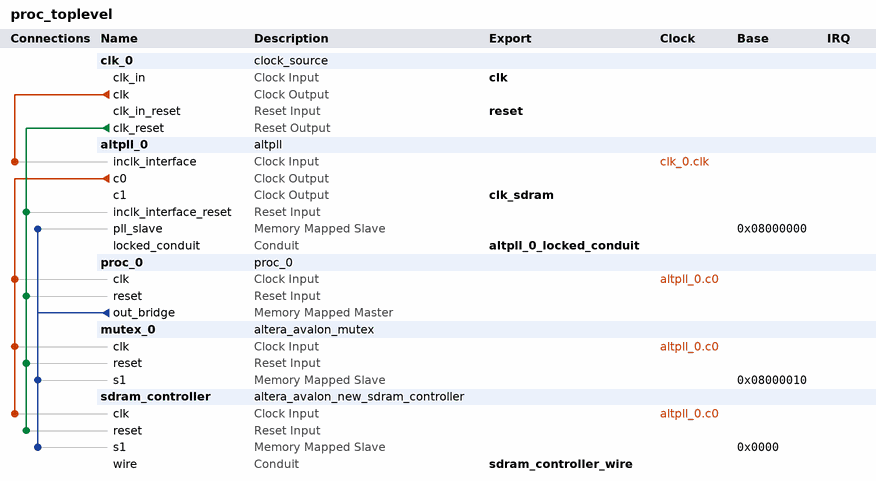
[diagram p0: system contents]
# Platform Designer (Qsys) system proc_toplevel, Cyclone IV E EP4CE115F29C7
# Parameters at their usual value, and those the tool derives, are not listed.
package require -exact qsys 16.1
create_system proc_toplevel
set_project_property DEVICE_FAMILY {Cyclone IV E}
set_project_property DEVICE EP4CE115F29C7

add_instance clk_0 clock_source 16.1
set_instance_parameter_value clk_0 clockFrequency 50000000

add_instance altpll_0 altpll 16.1
set_instance_parameter_value altpll_0 CLK0_DIVIDE_BY 50
set_instance_parameter_value altpll_0 CLK0_MULTIPLY_BY 143
set_instance_parameter_value altpll_0 CLK1_DIVIDE_BY 50
set_instance_parameter_value altpll_0 CLK1_DUTY_CYCLE 50
set_instance_parameter_value altpll_0 CLK1_MULTIPLY_BY 143
set_instance_parameter_value altpll_0 CLK1_PHASE_SHIFT -7000
set_instance_parameter_value altpll_0 COMPENSATE_CLOCK CLK1
set_instance_parameter_value altpll_0 INCLK0_INPUT_FREQUENCY 20000
set_instance_parameter_value altpll_0 PORT_ARESET PORT_UNUSED
set_instance_parameter_value altpll_0 PORT_LOCKED PORT_USED
set_instance_parameter_value altpll_0 PORT_clk1 PORT_USED
set_instance_parameter_value altpll_0 PORT_clk2 PORT_UNUSED
set_instance_parameter_value altpll_0 PORT_clk3 PORT_UNUSED

add_instance proc_0 proc_0 1.0

add_instance mutex_0 altera_avalon_mutex 16.1

add_instance sdram_controller altera_avalon_new_sdram_controller 16.1
set_instance_parameter_value sdram_controller TAC 5.4
set_instance_parameter_value sdram_controller TRCD 20.0
set_instance_parameter_value sdram_controller TRP 20.0
set_instance_parameter_value sdram_controller casLatency 3
set_instance_parameter_value sdram_controller columnWidth 10
set_instance_parameter_value sdram_controller dataWidth 32
set_instance_parameter_value sdram_controller generateSimulationModel false
set_instance_parameter_value sdram_controller model single_Micron_MT48LC4M32B2_7_chip
set_instance_parameter_value sdram_controller numberOfBanks 2
set_instance_parameter_value sdram_controller numberOfChipSelects 2
set_instance_parameter_value sdram_controller powerUpDelay 100.0
set_instance_parameter_value sdram_controller refreshPeriod 15.625
set_instance_parameter_value sdram_controller rowWidth 13

# connections
add_connection altpll_0.c0 mutex_0.clk clock
add_connection altpll_0.c0 proc_0.clk clock
add_connection altpll_0.c0 sdram_controller.clk clock
add_connection clk_0.clk altpll_0.inclk_interface clock
add_connection clk_0.clk_reset altpll_0.inclk_interface_reset reset
add_connection clk_0.clk_reset mutex_0.reset reset
add_connection clk_0.clk_reset proc_0.reset reset
add_connection clk_0.clk_reset sdram_controller.reset reset
add_connection proc_0.out_bridge altpll_0.pll_slave avalon
set_connection_parameter_value proc_0.out_bridge/altpll_0.pll_slave baseAddress 0x08000000
add_connection proc_0.out_bridge mutex_0.s1 avalon
set_connection_parameter_value proc_0.out_bridge/mutex_0.s1 baseAddress 0x08000010
add_connection proc_0.out_bridge sdram_controller.s1 avalon
set_connection_parameter_value proc_0.out_bridge/sdram_controller.s1 baseAddress 0x0000

# exported interfaces
add_interface altpll_0_locked_conduit conduit end
set_interface_property altpll_0_locked_conduit EXPORT_OF altpll_0.locked_conduit
add_interface clk clock sink
set_interface_property clk EXPORT_OF clk_0.clk_in
add_interface clk_sdram clock source
set_interface_property clk_sdram EXPORT_OF altpll_0.c1
add_interface reset reset sink
set_interface_property reset EXPORT_OF clk_0.clk_in_reset
add_interface sdram_controller_wire conduit end
set_interface_property sdram_controller_wire EXPORT_OF sdram_controller.wire

set_interconnect_requirement {$system} qsys_mm.clockCrossingAdapter HANDSHAKE
set_interconnect_requirement {$system} qsys_mm.enableEccProtection FALSE
set_interconnect_requirement {$system} qsys_mm.insertDefaultSlave FALSE
set_interconnect_requirement {$system} qsys_mm.maxAdditionalLatency 1

save_system proc_toplevel.qsys
